# Altium schematic sheet VoltageDivision.SchDoc
size A4; SheetNumber: 1; SheetTotal: 2
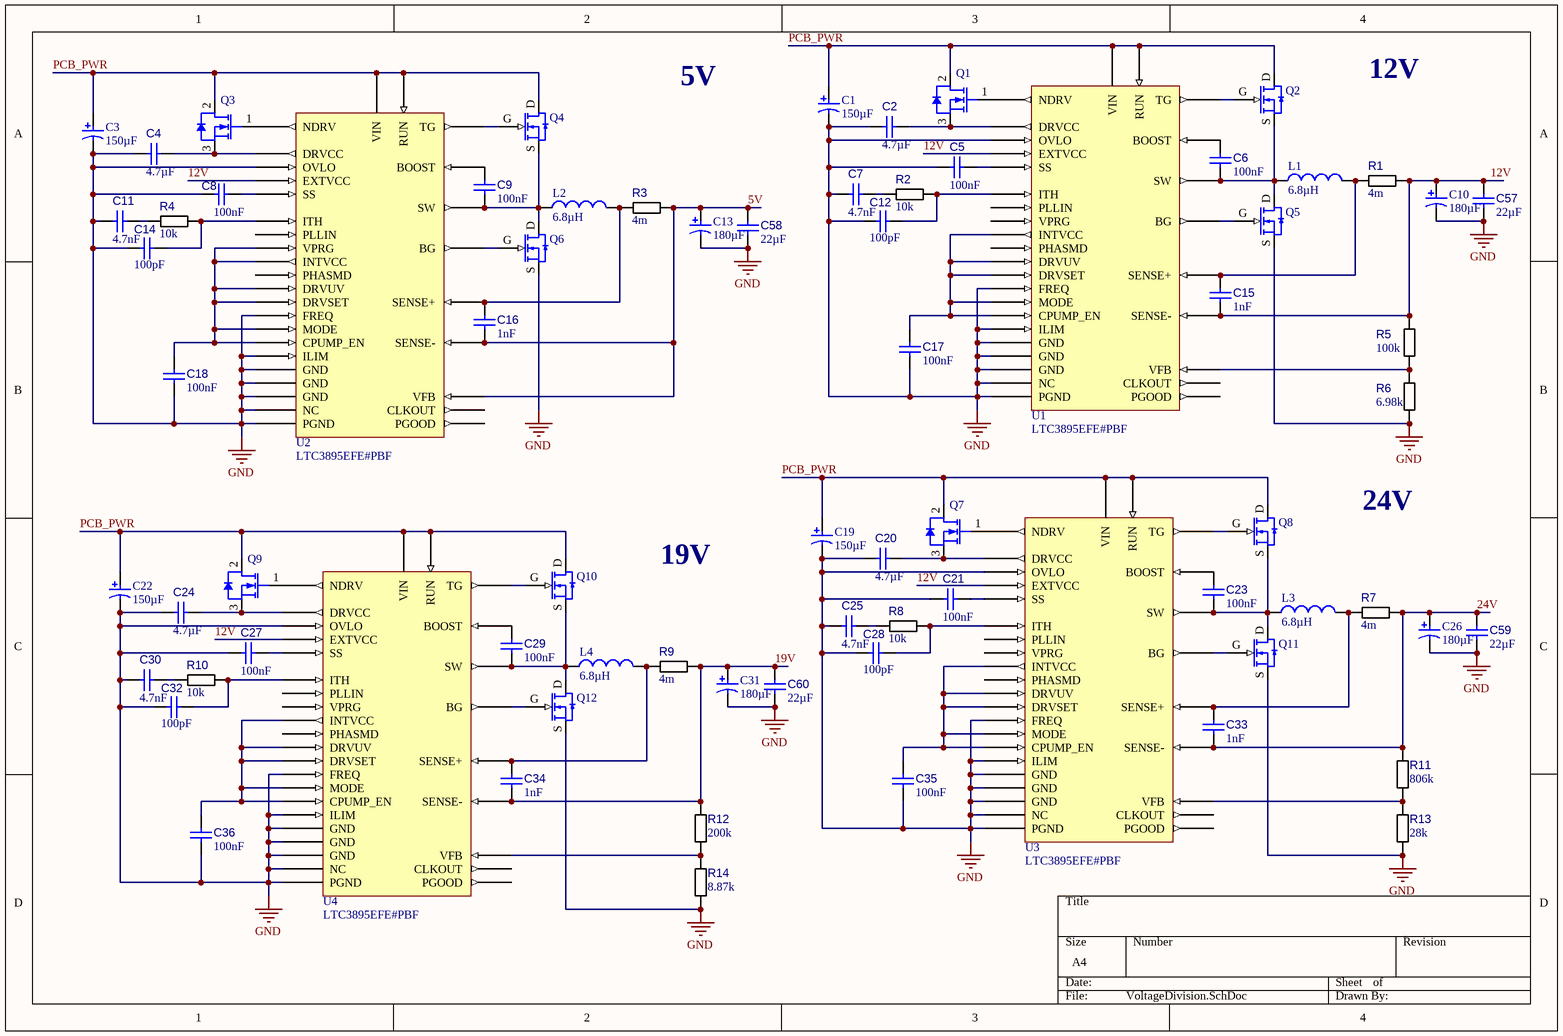
[diagram p0: VoltageDivision.SchDoc]

## Parts
C1  value 150µF  [CAPAE10083X105M]  (hidden comment: EEE-FN1H151UP)
C2  value 4.7µF  [FP-GRM31C-0_2-e0_3_0_8-IPC_A]  (hidden comment: 4.7uF 1206)
C3  value 150µF  [CAPAE10083X105M]  (hidden comment: EEE-FN1H151UP)
C4  value 4.7µF  [FP-GRM31C-0_2-e0_3_0_8-IPC_A]  (hidden comment: 4.7uF 1206)
C5  value 100nF  [CAPC1608X10N]  (hidden comment: 100nF 0603)
C6  value 100nF  [CAPC1608X10N]  (hidden comment: 100nF 0603)
C7  value 4.7nF  [CAPC1608X10N]  (hidden comment: CL10B472KB8NNNC)
C8  value 100nF  [CAPC1608X10N]  (hidden comment: 100nF 0603)
C9  value 100nF  [CAPC1608X10N]  (hidden comment: 100nF 0603)
C10  value 180µF  [CAPAE10083X105M]  (hidden comment: EEEFN1H181UP)
C11  value 4.7nF  [CAPC1608X10N]  (hidden comment: CL10B472KB8NNNC)
C12  value 100pF  [CAPC1608X10N]  (hidden comment: 100pF 0603)
C13  value 180µF  [CAPAE10083X105M]  (hidden comment: EEEFN1H181UP)
C14  value 100pF  [CAPC1608X10N]  (hidden comment: 100pF 0603)
C15  value 1nF  [CAPC1608X10N]  (hidden comment: 1nF 0603)
C16  value 1nF  [CAPC1608X10N]  (hidden comment: 1nF 0603)
C17  value 100nF  [CAPC1608X10N]  (hidden comment: 100nF 0603)
C18  value 100nF  [CAPC1608X10N]  (hidden comment: 100nF 0603)
C19  value 150µF  [CAPAE10083X105M]  (hidden comment: EEE-FN1H151UP)
C20  value 4.7µF  [FP-GRM31C-0_2-e0_3_0_8-IPC_A]  (hidden comment: 4.7uF 1206)
C21  value 100nF  [CAPC1608X10N]  (hidden comment: 100nF 0603)
C22  value 150µF  [CAPAE10083X105M]  (hidden comment: EEE-FN1H151UP)
C23  value 100nF  [CAPC1608X10N]  (hidden comment: 100nF 0603)
C24  value 4.7µF  [FP-GRM31C-0_2-e0_3_0_8-IPC_A]  (hidden comment: 4.7uF 1206)
C25  value 4.7nF  [CAPC1608X10N]  (hidden comment: CL10B472KB8NNNC)
C26  value 180µF  [CAPAE10083X105M]  (hidden comment: EEEFN1H181UP)
C27  value 100nF  [CAPC1608X10N]  (hidden comment: 100nF 0603)
C28  value 100pF  [CAPC1608X10N]  (hidden comment: 100pF 0603)
C29  value 100nF  [CAPC1608X10N]  (hidden comment: 100nF 0603)
C30  value 4.7nF  [CAPC1608X10N]  (hidden comment: CL10B472KB8NNNC)
C31  value 180µF  [CAPAE10083X105M]  (hidden comment: EEEFN1H181UP)
C32  value 100pF  [CAPC1608X10N]  (hidden comment: 100pF 0603)
C33  value 1nF  [CAPC1608X10N]  (hidden comment: 1nF 0603)
C34  value 1nF  [CAPC1608X10N]  (hidden comment: 1nF 0603)
C35  value 100nF  [CAPC1608X10N]  (hidden comment: 100nF 0603)
C36  value 100nF  [CAPC1608X10N]  (hidden comment: 100nF 0603)
C57  value 22µF  [CAPC5750X31N]  (hidden comment: FS55X226K500EHG)
C58  value 22µF  [CAPC5750X31N]  (hidden comment: FS55X226K500EHG)
C59  value 22µF  [CAPC5750X31N]  (hidden comment: FS55X226K500EHG)
C60  value 22µF  [CAPC5750X31N]  (hidden comment: FS55X226K500EHG)
L1  value 6.8µH  [INDP134126X50N]  (hidden comment: 6.8uH)
L2  value 6.8µH  [INDP134126X50N]  (hidden comment: 6.8uH)
L3  value 6.8µH  [INDP134126X50N]  (hidden comment: 6.8uH)
L4  value 6.8µH  [INDP134126X50N]  (hidden comment: 6.8uH)
Q1  IPD320N20N3GATMA1  [INF-PG-TO252-3-11_A_L]  (value not drawn)
Q2  BSC028N06LS3GATMA1  [INF-PG-TDSON-8-1_V]  (value not drawn)
Q3  IPD320N20N3GATMA1  [INF-PG-TO252-3-11_A_L]  (value not drawn)
Q4  BSC028N06LS3GATMA1  [INF-PG-TDSON-8-1_V]  (value not drawn)
Q5  BSC028N06LS3GATMA1  [INF-PG-TDSON-8-1_V]  (value not drawn)
Q6  BSC028N06LS3GATMA1  [INF-PG-TDSON-8-1_V]  (value not drawn)
Q7  IPD320N20N3GATMA1  [INF-PG-TO252-3-11_A_L]  (value not drawn)
Q8  BSC028N06LS3GATMA1  [INF-PG-TDSON-8-1_V]  (value not drawn)
Q9  IPD320N20N3GATMA1  [INF-PG-TO252-3-11_A_L]  (value not drawn)
Q10  BSC028N06LS3GATMA1  [INF-PG-TDSON-8-1_V]  (value not drawn)
Q11  BSC028N06LS3GATMA1  [INF-PG-TDSON-8-1_V]  (value not drawn)
Q12  BSC028N06LS3GATMA1  [INF-PG-TDSON-8-1_V]  (value not drawn)
R1  value 4m  [RESC6432X09N]  (hidden comment: FMF25FPJR004-LH)
R2  value 10k  [RESC1608X06N]  (hidden comment: 10k 0603)
R3  value 4m  [RESC6432X09N]  (hidden comment: FMF25FPJR004-LH)
R4  value 10k  [RESC1608X06N]  (hidden comment: 10k 0603)
R5  value 100k  [RESC1608X06N]  (hidden comment: 100k 0603)
R6  value 6.98k  [RESC1608X06N]  (hidden comment: 6.98k 0603)
R7  value 4m  [RESC6432X09N]  (hidden comment: FMF25FPJR004-LH)
R8  value 10k  [RESC1608X06N]  (hidden comment: 10k 0603)
R9  value 4m  [RESC6432X09N]  (hidden comment: FMF25FPJR004-LH)
R10  value 10k  [RESC1608X06N]  (hidden comment: 10k 0603)
R11  value 806k  [RESC1608X06N]  (hidden comment: 806k 0603)
R12  value 200k  [RESC1608X06N]  (hidden comment: 200kR 0603)
R13  value 28k  [RESC1608X06N]  (hidden comment: 28k 0603)
R14  value 8.87k  [RESC1608X06N]  (hidden comment: 8.87k 0603)
U1  LTC3895EFE#PBF  [TSSOP50P640X120_HS-39N]
U2  LTC3895EFE#PBF  [TSSOP50P640X120_HS-39N]
U3  LTC3895EFE#PBF  [TSSOP50P640X120_HS-39N]
U4  LTC3895EFE#PBF  [TSSOP50P640X120_HS-39N]

## Nets
GND: C1.2 C2.1 C3.2 C4.1 C5.2 C7.1 C8.2 C10.2 C11.1 C12.1 C13.2 C14.1 C17.1 C18.1 C19.2 C20.1 C21.2 C22.2 C24.1 C25.1 C26.2 C27.2 C28.1 C30.1 C31.2 C32.1 C35.1 C36.1 C57.2 C58.2 C59.2 C60.2 Q5.S Q6.S Q11.S Q12.S R6.1 R13.1 R14.1 U1.1(OVLO) U1.9(GND) U1.12(GND) U1.15(GND) U1.16(NC) U1.17(FREQ) U1.37(ILIM) U1.39(PGND) U2.1(OVLO) U2.9(GND) U2.12(GND) U2.15(GND) U2.16(NC) U2.17(FREQ) U2.37(ILIM) U2.39(PGND) U3.1(OVLO) U3.9(GND) U3.12(GND) U3.15(GND) U3.16(NC) U3.17(FREQ) U3.37(ILIM) U3.39(PGND) U4.1(OVLO) U4.9(GND) U4.12(GND) U4.15(GND) U4.16(NC) U4.17(FREQ) U4.37(ILIM) U4.39(PGND)
5V: C13.1 C16.1 C58.1 R3.2 U2.4(SENSE-) U2.6(VFB)
12V: C10.1 C15.1 C57.1 R1.2 R5.2 U1.4(SENSE-) U1.32(EXTVCC) U2.32(EXTVCC) U3.32(EXTVCC) U4.32(EXTVCC)
19V: C31.1 C34.1 C60.1 R9.2 R12.1 U4.4(SENSE-)
24V: C26.1 C33.1 C59.1 R7.2 R11.2 U3.4(SENSE-)
PCB_PWR: C1.1 C3.1 C19.1 C22.1 Q1.2(DRAIN) Q2.D Q3.2(DRAIN) Q4.D Q7.2(DRAIN) Q8.D Q9.2(DRAIN) Q10.D U1.30(VIN) U1.34(RUN) U2.30(VIN) U2.34(RUN) U3.30(VIN) U3.34(RUN) U4.30(VIN) U4.34(RUN)
NetC2_2: C2.2 Q1.3(SOURCE) U1.26(DRVCC)
NetC4_2: C4.2 Q3.3(SOURCE) U2.26(DRVCC)
NetC5_1: C5.1 U1.5(SS)
NetC6_1: C6.1 L1.1 Q2.S Q5.D U1.21(SW)
NetC6_2: C6.2 U1.22(BOOST)
NetC7_2: C7.2 R2.1
NetC8_1: C8.1 U2.5(SS)
NetC9_1: C9.1 L2.1 Q4.S Q6.D U2.21(SW)
NetC9_2: C9.2 U2.22(BOOST)
NetC11_2: C11.2 R4.1
NetC12_2: C12.2 R2.2 U1.7(ITH)
NetC14_2: C14.2 R4.2 U2.7(ITH)
NetC15_2: C15.2 L1.2 R1.1 U1.3(SENSE+)
NetC16_2: C16.2 L2.2 R3.1 U2.3(SENSE+)
NetC17_2: C17.2 U1.8(MODE) U1.10(CPUMP_EN) U1.18(DRVSET) U1.19(DRVUV) U1.38(INTVCC)
NetC18_2: C18.2 U2.2(VPRG) U2.8(MODE) U2.10(CPUMP_EN) U2.18(DRVSET) U2.19(DRVUV) U2.38(INTVCC)
NetC20_2: C20.2 Q7.3(SOURCE) U3.26(DRVCC)
NetC21_1: C21.1 U3.5(SS)
NetC23_1: C23.1 L3.1 Q8.S Q11.D U3.21(SW)
NetC23_2: C23.2 U3.22(BOOST)
NetC24_2: C24.2 Q9.3(SOURCE) U4.26(DRVCC)
NetC25_2: C25.2 R8.1
NetC27_1: C27.1 U4.5(SS)
NetC28_2: C28.2 R8.2 U3.7(ITH)
NetC29_1: C29.1 L4.1 Q10.S Q12.D U4.21(SW)
NetC29_2: C29.2 U4.22(BOOST)
NetC30_2: C30.2 R10.1
NetC32_2: C32.2 R10.2 U4.7(ITH)
NetC33_2: C33.2 L3.2 R7.1 U3.3(SENSE+)
NetC34_2: C34.2 L4.2 R9.1 U4.3(SENSE+)
NetC35_2: C35.2 U3.8(MODE) U3.10(CPUMP_EN) U3.18(DRVSET) U3.19(DRVUV) U3.38(INTVCC)
NetC36_2: C36.2 U4.8(MODE) U4.10(CPUMP_EN) U4.18(DRVSET) U4.19(DRVUV) U4.38(INTVCC)
NetQ1_1: Q1.1(GATE) U1.28(NDRV)
NetQ2_G: Q2.G U1.20(TG)
NetQ3_1: Q3.1(GATE) U2.28(NDRV)
NetQ4_G: Q4.G U2.20(TG)
NetQ5_G: Q5.G U1.24(BG)
NetQ6_G: Q6.G U2.24(BG)
NetQ7_1: Q7.1(GATE) U3.28(NDRV)
NetQ8_G: Q8.G U3.20(TG)
NetQ9_1: Q9.1(GATE) U4.28(NDRV)
NetQ10_G: Q10.G U4.20(TG)
NetQ11_G: Q11.G U3.24(BG)
NetQ12_G: Q12.G U4.24(BG)
NetR5_1: R5.1 R6.2 U1.6(VFB)
NetR11_1: R11.1 R13.2 U3.6(VFB)
NetR12_2: R12.2 R14.2 U4.6(VFB)

Not connected (* = marked no-connect by the designer): U1 2(VPRG) 11(CLKOUT) 13(PLLIN) 14(PGOOD) 36(PHASMD); U2 11(CLKOUT) 13(PLLIN) 14(PGOOD) 36(PHASMD); U3 2(VPRG) 11(CLKOUT) 13(PLLIN) 14(PGOOD) 36(PHASMD); U4 2(VPRG) 11(CLKOUT) 13(PLLIN) 14(PGOOD) 36(PHASMD)

## Notes on the sheet
- 5V
- 12V
- 24V
- 19V

## Library data of the parts
C1 C3 C19 C22 = CMP-001-00111-2: Cap Aluminum 150uF 50V 20% Cylindrical 0.34 Ohm 350mA 2000 hr 105°C Emboss T/R; Capacitor Type: Aluminum Electrolytic; Mounting Technology: SMD; ComponentLink1URL: https://jlcpcb.com/partdetail/Panasonic-EEEFN1H151UP/C494857; Pins: 2; ComponentLink1Description: JLCPCB; ComponentLink2Description: Datasheet; ComponentLink2URL: https://wmsc.lcsc.com/wmsc/upload/file/pdf/v2/lcsc/2401161636_PANASONIC-EEEFN1H151UP_C494857.pdf; Voltage Rating: 50V
C2 C4 C20 C24 = CMP-001-00105-1: Ceramic Capacitor, Multilayer, Ceramic, 50V, 10% +Tol, 10% -Tol, X7R, 15% TC, 4.7uF, Surface Mount, 1206; Multilayer: Yes; Tolerance (fill in as +-): 10%; Case/Package: 1206; Temperature Characteristics Code: X7R; Pins: 2; Width: 1.6mm; Min Operating Temperature: -55°C; Mounting Technology: Surface Mount; Length: 3.2mm; RoHS Compliant: Yes; Tolerance  (fill in as +-): 10%; Height: 1.6mm; Capacitor Type: Ceramic; Max Operating Temperature: 125°C
C5 C6 C8 C9 C17 C18 C21 C23 C27 C29 C35 C36 = CMP-001-00096-5: Ceramic Capacitor, Multilayer, Ceramic, 50V, 5% +Tol, 5% -Tol, X7R, 15% TC, 0.1uF, Surface Mount, 0603; Voltage Rating: 100V; ComponentLink1Description: JLCPCB; Max Operating Temperature: 125°C; ComponentLink2Description: Datasheet; Mounting Technology: SMD; ComponentLink1URL: https://jlcpcb.com/partdetail/25192-CL10B104JB8NNNC/C24452; Tolerance: 5%; Capacitor Type: Ceramic; Case/Package: 0603; RoHS Compliant: Yes; Min Operating Temperature: -55°C; ComponentLink2URL: https://jlcpcb.com/api/file/downloadByFileSystemAccessId/8563426422237782016; Pins: 2
C7 C11 C25 C30 = CMP-001-00109-2: Ceramic Capacitor, Multilayer, Ceramic, 50V, 10% +Tol, 10% -Tol, X7R, 15% TC, 0.0047uF, Surface Mount, 0603; Mounting Technology: Surface Mount; Min Operating Temperature: -55°C; Pins: 2; Capacitor Type: Ceramic; Tolerance  (fill in as +-): 10%; Width: 0.8mm; Case/Package: 0603; RoHS Compliant: Yes; Length: 1.6mm; Rated DC Voltage (URdc): 50V; Tolerance (fill in as +-): 10%; Temperature Characteristics Code: X7R; Height: 0.9mm; Max Operating Temperature: 125°C
C10 C13 C26 C31 = CMP-001-00102-4: Cap Aluminum 180uF 50V 20% Cylindrical 0.34 Ohm 350mA 2000 hr 105°C Emboss T/R; Capacitor Type: Aluminium; Ripple Current: 350mA; Case/Package: 3333; RoHS Compliant: Y; Mounting Technology: SMD; Voltage Rating: 50V; Pins: 2; Tolerance: 20%; ComponentLink1Description: JLCPCB; ComponentLink1URL: https://jlcpcb.com/partdetail/Panasonic-EEEFN1H181UP/C494858
C12 C14 C28 C32 = CMP-001-00098-6: 50V 100pF C0G ±5% 0603 Multilayer Ceramic Capacitors MLCC - SMD/SMT ROHS; Pins: 2; Capacitor Type: Ceramic; ComponentLink2Description: Datasheet; Tolerance: 5%; Case/Package: 0603; Mounting Technology: SMD; Min Operating Temperature: -55°C; Voltage Rating: 50V; ComponentLink1Description: JLCPCB; ComponentLink1URL: https://jlcpcb.com/partdetail/15530-CL10C101JB8NNNC/C14858; Max Operating Temperature: 125°C; ComponentLink2URL: https://jlcpcb.com/api/file/downloadByFileSystemAccessId/8579707092674142208; RoHS Compliant: Yes
C15 C16 C33 C34 = CMP-001-00101-2: 50V 1nF X7R ±10% 0603 Multilayer Ceramic Capacitors MLCC - SMD/SMT ROHS; RoHS Compliant: Yes; ComponentLink1URL: https://jlcpcb.com/partdetail/1940-CL10B102KB8NNNC/C1588; Capacitor Type: Ceramic; ComponentLink2URL: https://jlcpcb.com/api/file/downloadByFileSystemAccessId/8579706978448228352; Mounting Technology: Surface Mount; Pins: 2; Case/Package: 0603; Min Operating Temperature: -55°C; ComponentLink2Description: Datasheet; ComponentLink1Description: JLCPCB; Max Operating Temperature: 125°C
C57-C60 = CMP-001-00107-1: 50V 22uF X7R ±10% 2220  Multilayer Ceramic Capacitors MLCC - SMD/SMT ROHS; Capacitor Type: Ceramic; ComponentLink1URL: https://jlcpcb.com/partdetail/839503-FS55X226K500EHG/C784103; Voltage Rating: 50V; Mounting Technology: SMD; Tolerance: 10%; Case/Package: 2220; ComponentLink1Description: JLCPCB; Pins: 2
L1-L4 = CMP-006-00025-2: 12A 6.8uH ±20% 16A SMD,13.5x12.6mm  Power Inductors ROHS; Max Current Rating: 16A; ComponentLink1URL: https://jlcpcb.com/partdetail/Sunlord-MWSA1205S6R8MT/C408515; Pins: 2; Mounting Technology: SMD; Tolerance: 20%; ComponentLink2URL: https://jlcpcb.com/api/file/downloadByFileSystemAccessId/8552175007686930432; Current Rating: 12A; ComponentLink2Description: Datasheet; ComponentLink1Description: JLCPCB
Q1 Q3 Q7 Q9 = CMP-013-00038-2: Power Field-Effect Transistor, 34A I(D), 200V, 0.032ohm, 1-Element, N-Channel, Silicon, Metal-oxide Semiconductor FET, TO-252AA; Drain-source On Resistance-Max: 32mR; Number of Elements: 1; Case Connection: DRAIN; Transistor Application: SWITCHING; Operating Mode: ENHANCEMENT MODE; RoHS Compliant: Yes; Polarity/Channel Type: N-CHANNEL; Surface Mount: Yes; Drain Current-Max (ID): 34A; DS Breakdown Voltage-Min: 200V; Pins: 2
Q2 Q4-Q6 Q8 Q10-Q12 = CMP-013-00040-2: Power Field-Effect Transistor, 100A I(D), 60V, 0.0028ohm, 1-Element, N-Channel, Silicon, Metal-oxide Semiconductor FET; Drain Current-Max (ID): 23A; Case Connection: DRAIN; Operating Mode: ENHANCEMENT MODE; Drain-source On Resistance-Max: 2.8mR; Pins: 8; Polarity/Channel Type: N-CHANNEL; Max Operating Temperature: 150°C; RoHS Compliant: Yes; Surface Mount: Yes; DS Breakdown Voltage-Min: 60V
R1 R3 R7 R9 = CMP-009-00199-3: 2W 4mΩ ±50ppm/℃ ±1% 2512  Current Sense Resistors/Shunt Resistors ROHS; RoHS Compliant: Y; ComponentLink1Description: JLCPCB; ComponentLink2URL: https://jlcpcb.com/api/file/downloadByFileSystemAccessId/8588898600813912064; Case/Package: 2512; Tolerance: 1%; ComponentLink1URL: https://jlcpcb.com/partdetail/106603-FMF25FPJR004LH/C105388; Pins: 2; Power: 2W; Mounting Technology: SMD; ComponentLink2Description: Datasheet
R2 R4 R8 R10 = CMP-009-00179-6: Fixed Resistor, Metal Glaze/thick Film, 0.1W, 10000ohm, 75V, 1% +/-Tol, 100ppm/Cel, Surface Mount, 0603; Package Width: 0.8mm; Production ID: ERJ3EKF1002V; Power: 100mW; Package Length: 1.6mm; Package Height: 0.45mm; Min Operating Temperature: -55°C; Max Operating Temperature: 155°C; Case/Package: 0603; RoHS Compliant: Yes; ComponentLink2URL: https://4donline.ihs.com/images/VipMasterIC/IC/PANA/PANA-S-A0017042869/PANA-S-A0017226718-1.pdf?hkey=6D3A4C79FDBF58556ACFDE234799DDF0; Pins: 2; Tolerance: 1%; ComponentLink1URL: https://ee.farnell.com/panasonic/erju3rd1002v/res-10k-0-5-0-1w-0603/dp/3597621; ComponentLink3Description: JLCPCB; ComponentLink1Description: Farnell; ComponentLink2Description: Datasheet; ComponentLink3URL: https://jlcpcb.com/partdetail/Panasonic-ERJ3EKF1002V/C191124; Mounting Technology: Surface Mount; Voltage Rating: 75V
R5 = CMP-009-00184-4: 100mW Thick Film Resistors 75V ±100ppm/℃ ±1% 100kΩ 0603 Chip Resistor - Surface Mount ROHS; Package Width: 0.8mm; Package Height: 0.45mm; Package Length: 1.6mm; Production ID: ERJ3EKF1003V; Mounting Technology: SMD; ComponentLink2URL: https://www.lcsc.com/datasheet/lcsc_datasheet_1809281124_YAGEO-RC0603FR-07100KL_C14675.pdf; Voltage Rating: 75V; Max Operating Temperature: 155°C; Power: 100mW; ComponentLink2Description: Datasheet; Min Operating Temperature: -55°C; Tolerance: 1%; Case/Package: 0603; Pins: 2; RoHS Compliant: Yes; ComponentLink1Description: JLCPCB; ComponentLink1URL: https://jlcpcb.com/partdetail/Yageo-RC0603FR07100KL/C14675
R6 = CMP-009-00197-2: 100mW Thick Film Resistors 75V ±100ppm/℃ ±1% 6.98kΩ 0603 Chip Resistor - Surface Mount ROHS; ComponentLink2URL: https://www.lcsc.com/datasheet/lcsc_datasheet_2206010116_UNI-ROYAL-Uniroyal-Elec-0603WAF6981T5E_C23215.pdf; ComponentLink2Description: Datasheet; ComponentLink1Description: JLCPCB; Voltage Rating: 75V; Power: 100mW; Case/Package: 0603; Tolerance: 1%; ComponentLink1URL: https://jlcpcb.com/partdetail/23942-0603WAF6981T5E/C23215; Mounting Technology: SMD; Pins: 2
R11 = CMP-009-00206-2: Fixed Resistor, Metal Glaze/thick Film, 0.1W, 806000ohm, 75V, 1% +/-Tol, 100ppm/Cel, Surface Mount, 0603; Package Height: 0.45mm; Package Length: 1.6mm; Package Width: 0.8mm; Power: 100mW; Max Operating Temperature: 155°C; RoHS Compliant: Yes; Case/Package: 0603; Pins: 2; Min Operating Temperature: -55°C; Tolerance: 1%; Working Voltage: 75V; Mounting Technology: Surface Mount
R12 = CMP-009-00204-2: Fixed Resistor, Metal Glaze/thick Film, 0.1W, 200000ohm, 75V, 1% +/-Tol, 100ppm/Cel, Surface Mount, 0603; Package Width: 0.8mm; Power: 100mW; Package Height: 0.45mm; Package Length: 1.6mm; Max Operating Temperature: 155°C; Tolerance: 1%; RoHS Compliant: Yes; Case/Package: 0603; Pins: 2; Mounting Technology: Surface Mount; Min Operating Temperature: -55°C
R13 = CMP-009-00207-2: Fixed Resistor, Metal Glaze/thick Film, 0.1W, 28000ohm, 75V, 1% +/-Tol, 100ppm/Cel, Surface Mount, 0603; Package Height: 0.45mm; Package Width: 0.8mm; Power: 100mW; Package Length: 1.6mm; Mounting Technology: Surface Mount; Max Operating Temperature: 155°C; Tolerance: 1%; Pins: 2; RoHS Compliant: Yes; Min Operating Temperature: -55°C; Case/Package: 0603
R14 = CMP-009-00205-2: Fixed Resistor, Metal Glaze/thick Film, 0.1W, 8870ohm, 75V, 1% +/-Tol, 100ppm/Cel, Surface Mount, 0603; Package Width: 0.8mm; Power: 100mW; Package Length: 1.6mm; Package Height: 0.45mm; Rated Temperature: 70°C; Working Voltage: 75V; Tolerance: 1%; Case/Package: 0603; Pins: 2; RoHS Compliant: Yes; Mounting Technology: Surface Mount; Min Operating Temperature: -55°C; Max Operating Temperature: 155°C
U1-U4 = CMP-031-00009-9: Switching Controller, Current-mode, 900kHz Switching Freq-Max, CMOS, PDSO38; Switcher Configuration: BUCK; Max Supply Voltage: 140V; Width: 4.4mm; RoHS Compliant: Yes; Length: 9.7mm; Surface Mount: Yes; Frequency: 900kHz; Throw Configuration: SWITCHING CONTROLLER; Height - Seated (Max): 1.2mm; Pins: 38; Case/Package: HTSSOP